# Altium project PowerLatch.PrjPcb
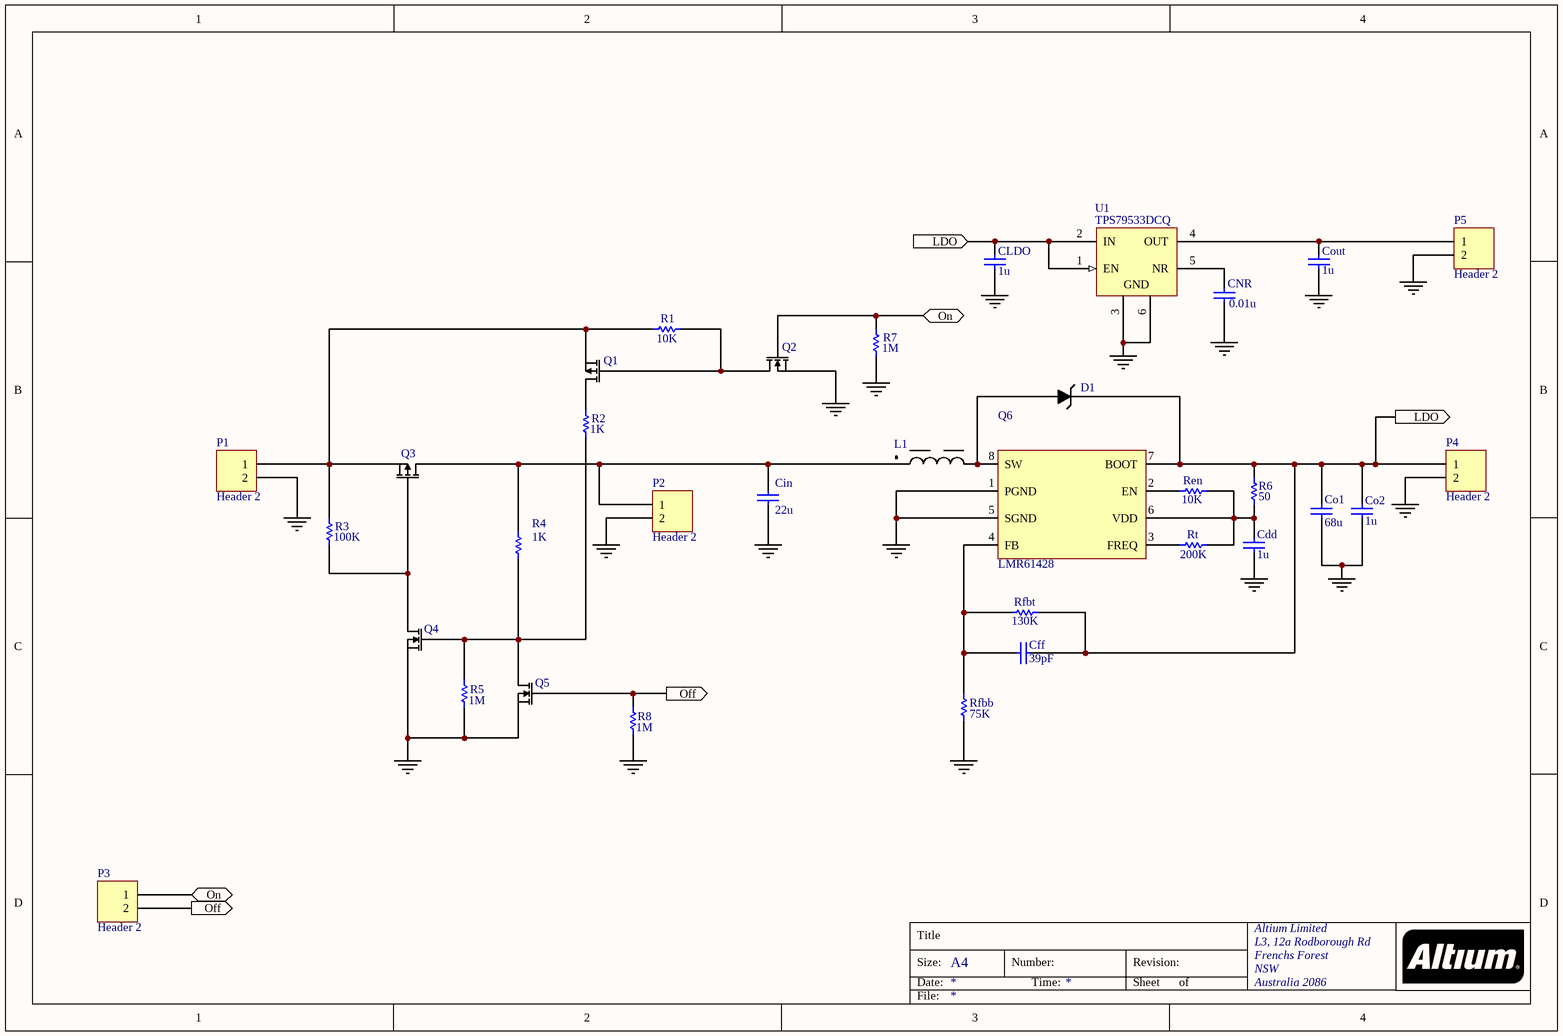
[diagram p0: PowerLatch.SchDoc]
1 sheet, 34 parts. Net scope: flat (ports and power ports of the same name join across sheets).
Board file: PowerLatch.PcbDoc

## Sheet PowerLatch.SchDoc
size A4; Organization: Altium Limited; Address1: L3, 12a Rodborough Rd; Address2: Frenchs Forest; Address3: NSW; Address4: Australia 2086

### Parts
Cdd  value 1u  [RESC1608X06N]  (hidden comment: Cap)
Cff  value 39pF  [RESC1608X06N]  (hidden comment: Cap)
Cin  value 22u  [CAPMP7343X31N]  (hidden comment: Cap)
CLDO  value 1u  [RESC1608X06N]  (hidden comment: Cap)
CNR  value 0.01u  [RESC1608X06N]  (hidden comment: Cap)
Co1  value 68u  [CAP2812]  (hidden comment: Cap)
Co2  value 1u  [CAPC0805]  (hidden comment: Cap)
Cout  value 1u  [RESC1608X06N]  (hidden comment: Cap)
D1  Schottky  [DIOM4326X23N]  (value not drawn)
L1  Inductor  [INDP100100X51N]  (value not drawn)
P1  Header 2  [PCBComponent_1]
P2  Header 2  [PCBComponent_1]
P3  Header 2  [PCBComponent_1]
P4  Header 2  [PCBComponent_1]
P5  Header 2  [PCBComponent_1]
Q1  MOSFET P-Channel  [SOT95P245X110-3N]  (value not drawn)
Q2  MOSFET N-Channel  [SOT95P245X110-3N]  (value not drawn)
Q3  MOSFET P-Channel  [SOT95P245X110-3N]  (value not drawn)
Q4  MOSFET N-Channel  [SOT95P245X110-3N]  (value not drawn)
Q5  MOSFET N-Channel  [SOT95P245X110-3N]  (value not drawn)
Q6  LMR61428  [TSOP65P490X110-8N]
R1  value 10K  [RESC1608X06N]  (hidden comment: Res1)
R2  value 1K  [RESC1608X06N]  (hidden comment: Res1)
R3  value 100K  [RESC1608X06N]  (hidden comment: Res1)
R4  value 1K  [RESC1608X06N]  (hidden comment: Res1)
R5  value 1M  [RESC1608X06N]  (hidden comment: Res1)
R6  value 50  [RESC1608X06N]  (hidden comment: Res1)
R7  value 1M  [RESC1608X06N]  (hidden comment: Res1)
R8  value 1M  [RESC1608X06N]  (hidden comment: Res1)
Ren  value 10K  [RESC1608X06N]  (hidden comment: Res1)
Rfbb  value 75K  [RESC1608X06N]  (hidden comment: Res1)
Rfbt  value 130K  [RESC1608X06N]  (hidden comment: Res1)
Rt  value 200K  [RESC1608X06N]  (hidden comment: Res1)
U1  TPS79533DCQ  [DCQ0006A_L]

### Ports
LDO (in), LDO (out), Off (out), On (bidir)

### Nets
GND: Cdd.1 Cin.2 CLDO.1 CNR.1 Co1.2 Co2.1 Cout.1 P1.2 P2.2 P4.2 P5.2 Q2.2(S) Q4.2(S) Q5.2(S) Q6.1(PGND) Q6.5(SGND) R5.1 R7.1 R8.1 Rfbb.2 U1.3(GND) U1.6(GND)
NetCdd_2: Cdd.2 Q6.6(VDD) R6.2 Ren.2 Rt.2
NetCff_1: Cff.1 CLDO.2 Co1.1 Co2.2 D1.2(K) P4.1 Q6.7(BOOT) R6.1 Rfbt.2 U1.1(EN) U1.2(IN) ; port LDO
NetCff_2: Cff.2 Q6.4(FB) Rfbb.1 Rfbt.1
NetCin_1: Cin.1 L1.1 P2.1 Q3.3(D) R4.2
NetCNR_2: CNR.2 U1.5(NR)
NetCout_2: Cout.2 P5.1 U1.4(OUT)
NetD1_1: D1.1(A) L1.2 Q6.8(SW)
NetP1_1: P1.1 Q1.2(S) Q3.2(S) R1.2 R3.2
NetP3_1: P3.1 Q2.1(G) R7.2 ; port On
NetP3_2: P3.2 Q5.1(G) R8.2 ; port Off
NetQ1_1: Q1.1(G) Q2.3(D) R1.1
NetQ1_3: Q1.3(D) R2.2
NetQ3_1: Q3.1(G) Q4.3(D) R3.1
NetQ4_1: Q4.1(G) Q5.3(D) R2.1 R4.1 R5.2
NetQ6_2: Q6.2(EN) Ren.1
NetQ6_3: Q6.3(FREQ) Rt.1

### Notes on the sheet
- Title
- Size:
- Date:
- A4
- Number:
- Time:
- Revision:
- Sheet
- of
- File:

### Library data of the parts
Cdd Cff Cin CLDO CNR Co1 Co2 Cout = Cap: Capacitor; Published: 8-Jun-2000; LatestRevisionDate: 17-Jul-2002; LatestRevisionNote: Re-released for DXP Platform.; PackageReference: RAD-0.3; Publisher: Altium Limited; PackageDescription: Radial Cap, Thru-Hole; 2 Leads; 0.3 in Pin Spacing
P1-P5 = Header 2: Header, 2-Pin; LatestRevisionDate: 17-Jul-2002; LatestRevisionNote: Re-released for DXP Platform.; Publisher: Altium Limited
Q6 = LMR61428: Step-Up Voltage Regulator
R1-R8 Ren Rfbb Rfbt Rt = Res1: Resistor; Published: 8-Jun-2000; LatestRevisionDate: 17-Jul-2002; LatestRevisionNote: Re-released for DXP Platform.; PackageReference: AXIAL-0.3; Publisher: Altium Limited; PackageDescription: Axial Device, Thru-Hole; 2 Leads; 0.3 in Pin Spacing
U1 = CMP-0395-00363-2: Single Output High PSRR LDO, 500 mA, Fixed 3.3 V Output, 2.7 to 5.5 V Input, 6-pin SOT-223 (DCQ), Green (RoHS & no Sb/Br); Manufacturer: Texas Instruments; Fixed Output Options(V): 3.3; Vin(Max)(V): 5.5; Rating: Catalog; Vin(Min)(V): 2.7; Iq(Typ)(mA): 0.26; Accuracy(%): 2; Vdo(Typ)(mV): 105; Iout(Max)(A): 0.5; SubFamily: Single Channel LDO; Eco-Plan: Green (RoHS & no Sb/Br); ComponentLink2Description: Datasheet; ComponentLink3Description: Package Specification; ComponentLink2URL: http://www.ti.com/general/docs/lit/getliterature.tsp?genericPartNumber=TPS79533&fileType=pdf; PackageVersion: 4202109/D; PackageReference: DCQ0006A; Vout Adj(Max)(V): 3.3; Vout Adj(Min)(V): 3.3; PartNumber: TPS79533DCQ; PackageDescription: 6-Pin Plastic Small Outline, Body 3.5 x 6.5 mm, Pitch 1.27 mm; ComponentLink1Description: Manufacturer URL; DatasheetVersion: SLVS350H; Mounting Technology: Surface Mount; ComponentLink1URL: http://www.ti.com/; ComponentLink3URL: http://www.ti.com/litv/pdf/mpds098c